# EAGLE schematic ParametricMidPCB_V_1_0 (EAGLE 9.5.2)
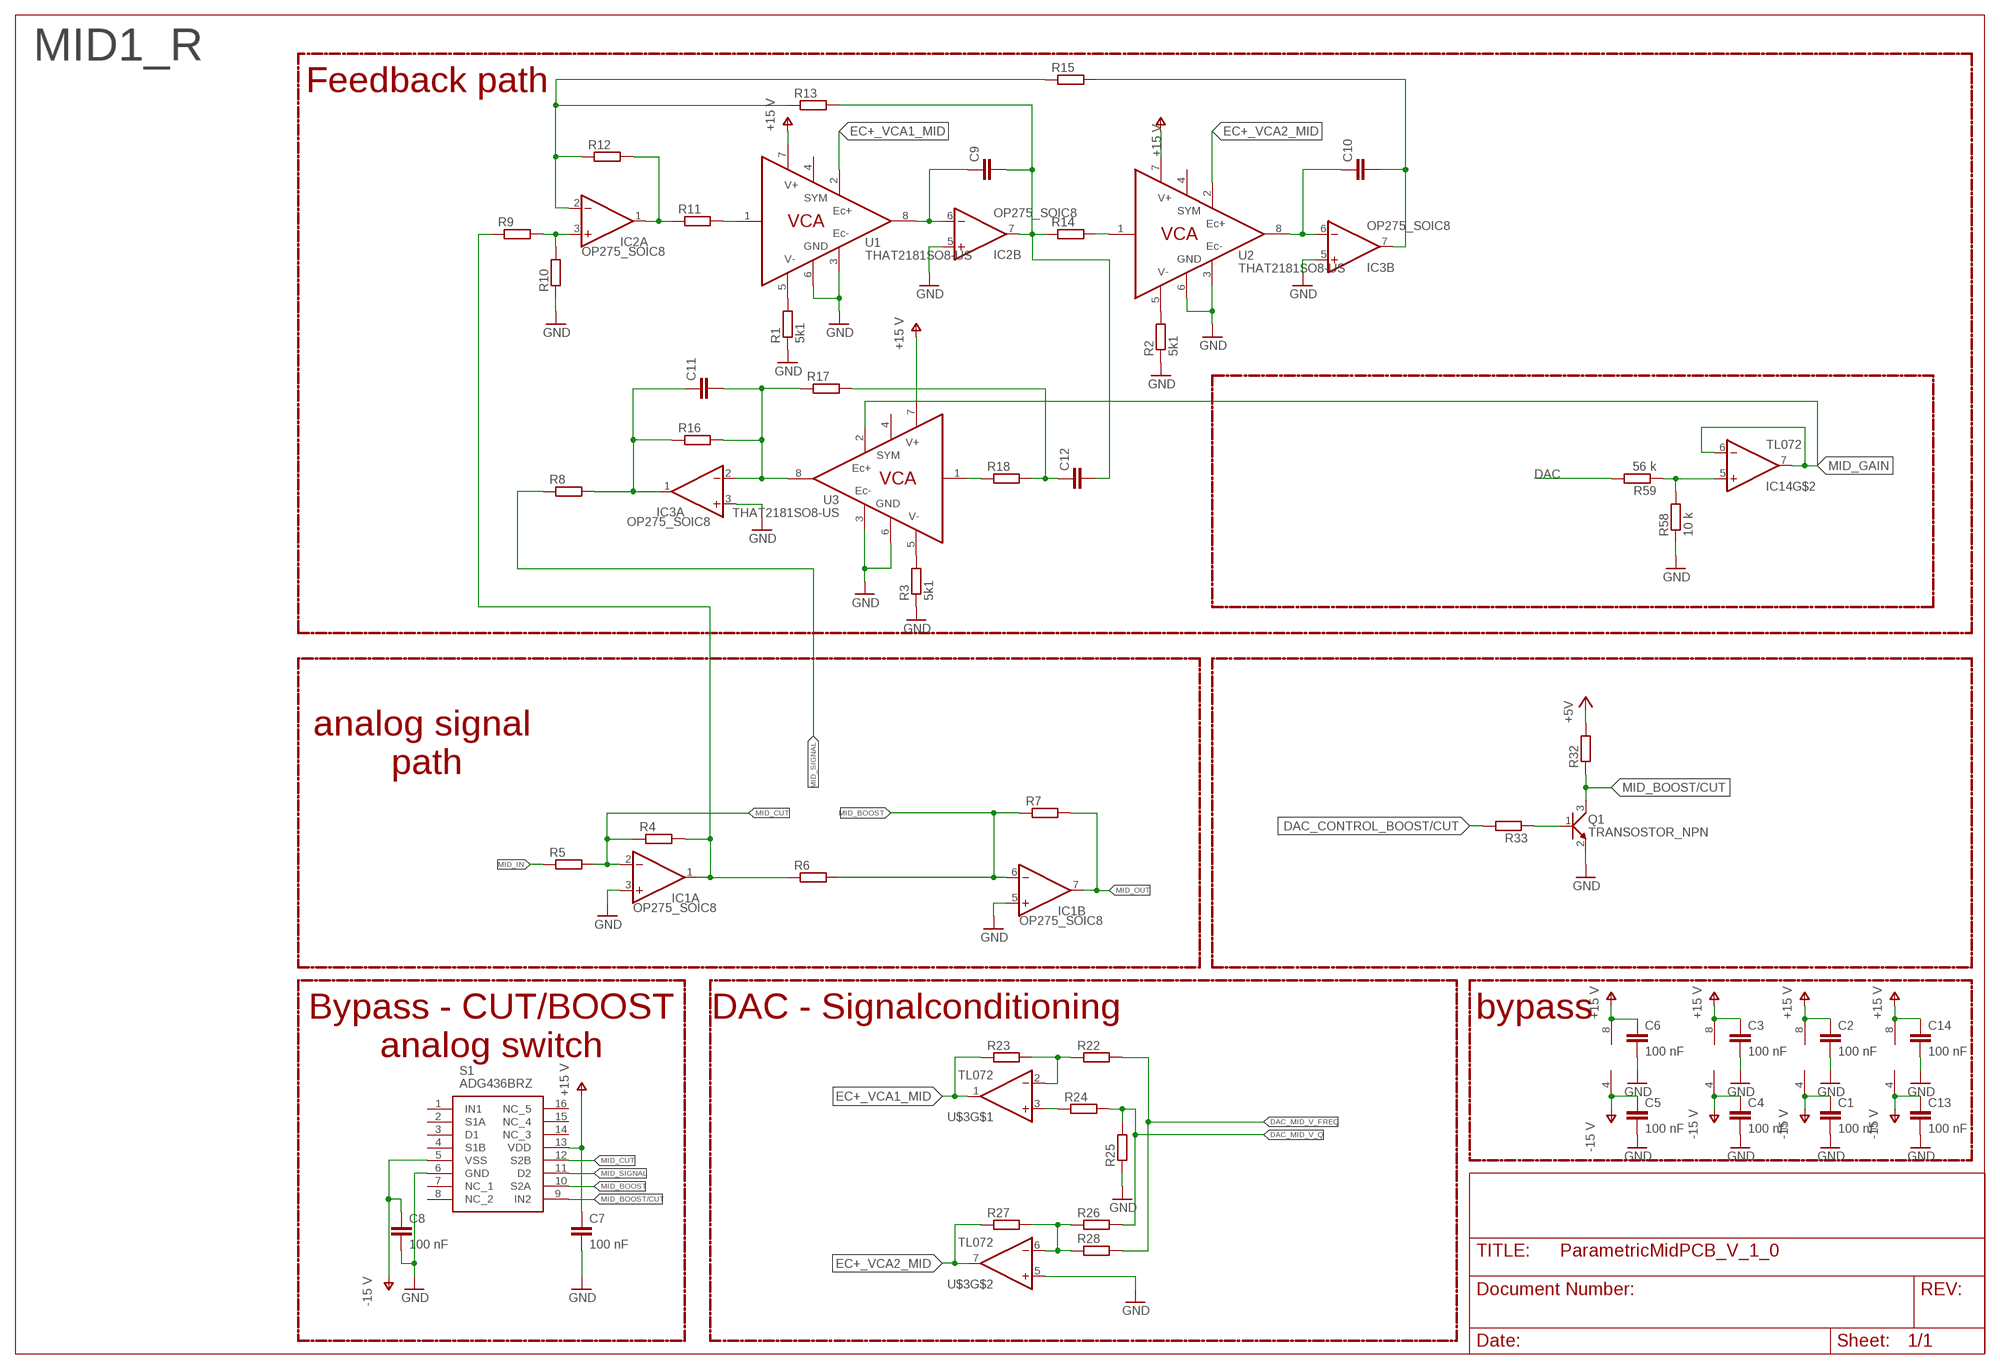
[diagram p0: schematic, sheet 1]

## Parts
C1  100 nF  CAPACITOR_0603  [C0603]
C2  100 nF  CAPACITOR_0603  [C0603]
C3  100 nF  CAPACITOR_0603  [C0603]
C4  100 nF  CAPACITOR_0603  [C0603]
C5  100 nF  CAPACITOR_0603  [C0603]
C6  100 nF  CAPACITOR_0603  [C0603]
C7  100 nF  CAPACITOR_0603  [C0603]
C8  100 nF  CAPACITOR_0603  [C0603]
C9  CAPACITOR_0603  [C0603]
C10  CAPACITOR_0603  [C0603]
C11  CAPACITOR_0603  [C0603]
C12  CAPACITOR_0603  [C0603]
C13  100 nF  CAPACITOR_0603  [C0603]
C14  100 nF  CAPACITOR_0603  [C0603]
IC1  OP275_SOIC8  [SOIC8]
IC2  OP275_SOIC8  [SOIC8]
IC3  OP275_SOIC8  [SOIC8]
IC14  TL072  [SOIC8]
Q1  TRANSOSTOR_NPN  [SOT96P237X111-3N]
R1  5k1  RESISTOR_0603  [R0603]
R2  5k1  RESISTOR_0603  [R0603]
R3  5k1  RESISTOR_0603  [R0603]
R4  RESISTOR_0603  [R0603]
R5  RESISTOR_0603  [R0603]
R6  RESISTOR_0603  [R0603]
R7  RESISTOR_0603  [R0603]
R8  RESISTOR_0603  [R0603]
R9  RESISTOR_0603  [R0603]
R10  RESISTOR_0603  [R0603]
R11  RESISTOR_0603  [R0603]
R12  RESISTOR_0603  [R0603]
R13  RESISTOR_0603  [R0603]
R14  RESISTOR_0603  [R0603]
R15  RESISTOR_0603  [R0603]
R16  RESISTOR_0603  [R0603]
R17  RESISTOR_0603  [R0603]
R18  RESISTOR_0603  [R0603]
R22  RESISTOR_0603  [R0603]
R23  RESISTOR_0603  [R0603]
R24  RESISTOR_0603  [R0603]
R25  RESISTOR_0603  [R0603]
R26  RESISTOR_0603  [R0603]
R27  RESISTOR_0603  [R0603]
R28  RESISTOR_0603  [R0603]
R32  RESISTOR_0603  [R0603]
R33  RESISTOR_0603  [R0603]
R58  10 k  RESISTOR_0603  [R0603]
R59  56 k  RESISTOR_0603  [R0603]
S1  ADG436BRZ  [SOIC127P600X175-16N]
U1  THAT2181SO8-US  [SO08]
U2  THAT2181SO8-US  [SO08]
U3  THAT2181SO8-US  [SO08]
U$3  TL072  [SOIC8]

## Nets
+5V: R32.2
DAC: R59.2
DAC_CONTROL_BOOST/CUT: R33.2
DAC_MID_V_FREQ: R22.2 R28.2
DAC_MID_V_Q: R24.2 R25.2 R26.2
EC+_VCA1_MID: R23.1 U1.2(EC+) U$3.1(OUT)
EC+_VCA2_MID: R27.1 U2.2(EC+) U$3.7(OUT)
GND: C1.2 C2.2 C3.2 C4.2 C5.2 C6.2 C7.2 C8.2 C13.2 C14.2 IC1.3(A:+IN) IC1.5(B:+IN) IC2.5(B:+IN) IC3.3(A:+IN) IC3.5(B:+IN) Q1.2(E) R1.1 R2.1 R3.1 R10.1 R25.1 R58.1 S1.6(GND) U1.3(EC-) U1.6(GND) U2.3(EC-) U2.6(GND) U3.3(EC-) U3.6(GND) U$3.5(+IN)
MID_BOOST: IC1.6(B:-IN) R6.2 R7.1 S1.10(S2A)
MID_BOOST/CUT: Q1.3(C) R32.1 S1.9(IN2)
MID_CUT: IC1.2(A:-IN) R4.1 R5.2 S1.12(S2B)
MID_GAIN: IC14.6(-IN) IC14.7(OUT) U3.2(EC+)
MID_IN: R5.1
MID_OUT: IC1.7(B:OUT) R7.2
MID_SIGNAL: R8.1 S1.11(D2)
N$1: R1.2 U1.5(V-)
N$2: R2.2 U2.5(V-)
N$3: R3.2 U3.5(V-)
N$4: IC2.3(A:+IN) R9.2 R10.2
N$5: IC1.1(A:OUT) R4.2 R6.1 R9.1
N$6: IC2.2(A:-IN) R12.1 R13.1 R15.1
N$7: IC2.1(A:OUT) R11.1 R12.2
N$8: R11.2 U1.1(IN)
N$9: C9.1 IC2.6(B:-IN) U1.8(OUT)
N$10: C9.2 C12.2 IC2.7(B:OUT) R13.2 R14.1
N$11: R14.2 U2.1(IN)
N$12: C10.1 IC3.6(B:-IN) U2.8(OUT)
N$13: C11.1 IC3.1(A:OUT) R8.2 R16.1
N$14: C10.2 IC3.7(B:OUT) R15.2
N$15: C11.2 IC3.2(A:-IN) R16.2 R17.1 U3.8(OUT)
N$16: R18.1 U3.1(IN)
N$17: C12.1 R17.2 R18.2
N$21: R22.1 R23.2 U$3.2(-IN)
N$22: R24.1 U$3.3(+IN)
N$23: R26.1 R27.2 R28.1 U$3.6(-IN)
N$29: Q1.1(B) R33.1
N$66: IC14.5(+IN) R58.2 R59.1
V+: C2.1 C3.1 C6.1 C7.1 C14.1 IC1.8(P:V+) IC2.8(P:V+) IC3.8(P:V+) S1.13(VDD) U1.7(V+) U2.7(V+) U3.7(V+) U$3.8(V+) ; supply symbol labelled +15 V
V-: C1.1 C4.1 C5.1 C8.1 C13.1 IC1.4(P:V-) IC2.4(P:V-) IC3.4(P:V-) S1.5(VSS) U$3.4(V-) ; supply symbol labelled -15 V
Unconnected: IC14.1(OUT) IC14.2(-IN) IC14.3(+IN) S1.1(IN1) S1.2(S1A) S1.3(D1) S1.4(S1B) S1.7(NC_1) S1.8(NC_2) S1.14(NC_3) S1.15(NC_4) S1.16(NC_5) U1.4(SYM) U2.4(SYM) U3.4(SYM)

## Notes on the sheet
- MID1_R
- Feedback path
- analog signal 
  path
- Bypass - CUT/BOOST
  analog switch
- DAC - Signalconditioning | bypass

## Power pins joined to a net without a drawn wire
V+: IC14.8(V+)
V-: IC14.4(V-)

## Library data of the parts
C1-C14 = passive components:CAPACITOR: ceramic capacitor
IC1-IC3 = OP-AMPS:OP275: Dual Very Low Noise Precision Operational Amplifier Source: http://www.analog.com/static/imported-files/data_sheets/OP270.pdf; MOUSER_PART_NUMBER: 584-OP275GSZ-R7
IC14 U$3 = OP-AMPS:TL072: Datasheet: http://www.ti.com/general/docs/suppproductinfo.tsp?distId=26&gotoUrl=http%3A%2F%2Fwww.ti.com%2Flit%2Fgpn%2Ftl072; MOUSER_PART_NUMBER: 595-TL072CDR
Q1 = active components:TRANSOSTOR_NPN: Source: Datasheet <https://componentsearchengine.com/Datasheets/1/BC850CLT1G.pdf>; HEIGHT: 1.11mm; MANUFACTURER_NAME: ON Semiconductor; MANUFACTURER_PART_NUMBER: BC850CLT1G; MOUSER_PART_NUMBER: 863-BC850CLT1G; MOUSER_PRICE-STOCK: https://www.mouser.com/Search/Refine.aspx?Keyword=863-BC850CLT1G
R1-R18 R22-R28 R32 R33 R58 R59 = passive components:RESISTOR: +/- 5 % resistor
S1 = analog switches:ADG436BRZ: Analog Devices ADG436BRZ, Analogue SPDT Switch Dual SPDT, 5 V, 9 V, 12 V, 15 V, 18 V, 24 V, 28 V, 16-Pin SOIC Source: Datasheet <https://componentsearchengine.com/Datasheets/1/ADG436BRZ.pdf>; DESCRIPTION: Analog Devices ADG436BRZ, Analogue SPDT Switch Dual SPDT, 5 V, 9 V, 12 V, 15 V, 18 V, 24 V, 28 V, 16-Pin SOIC; HEIGHT: 1.75mm; MANUFACTURER_NAME: Analog Devices; MANUFACTURER_PART_NUMBER: ADG436BRZ; MOUSER_PART_NUMBER: 584-ADG436BRZ; MOUSER_PRICE-STOCK: https://www.mouser.com/Search/Refine.aspx?Keyword=584-ADG436BRZ
U1-U3 = THAT_Library:THAT2181: VCA Trimmable IC; MOUSER_PART_NUMBER: 887-2181CS08-U